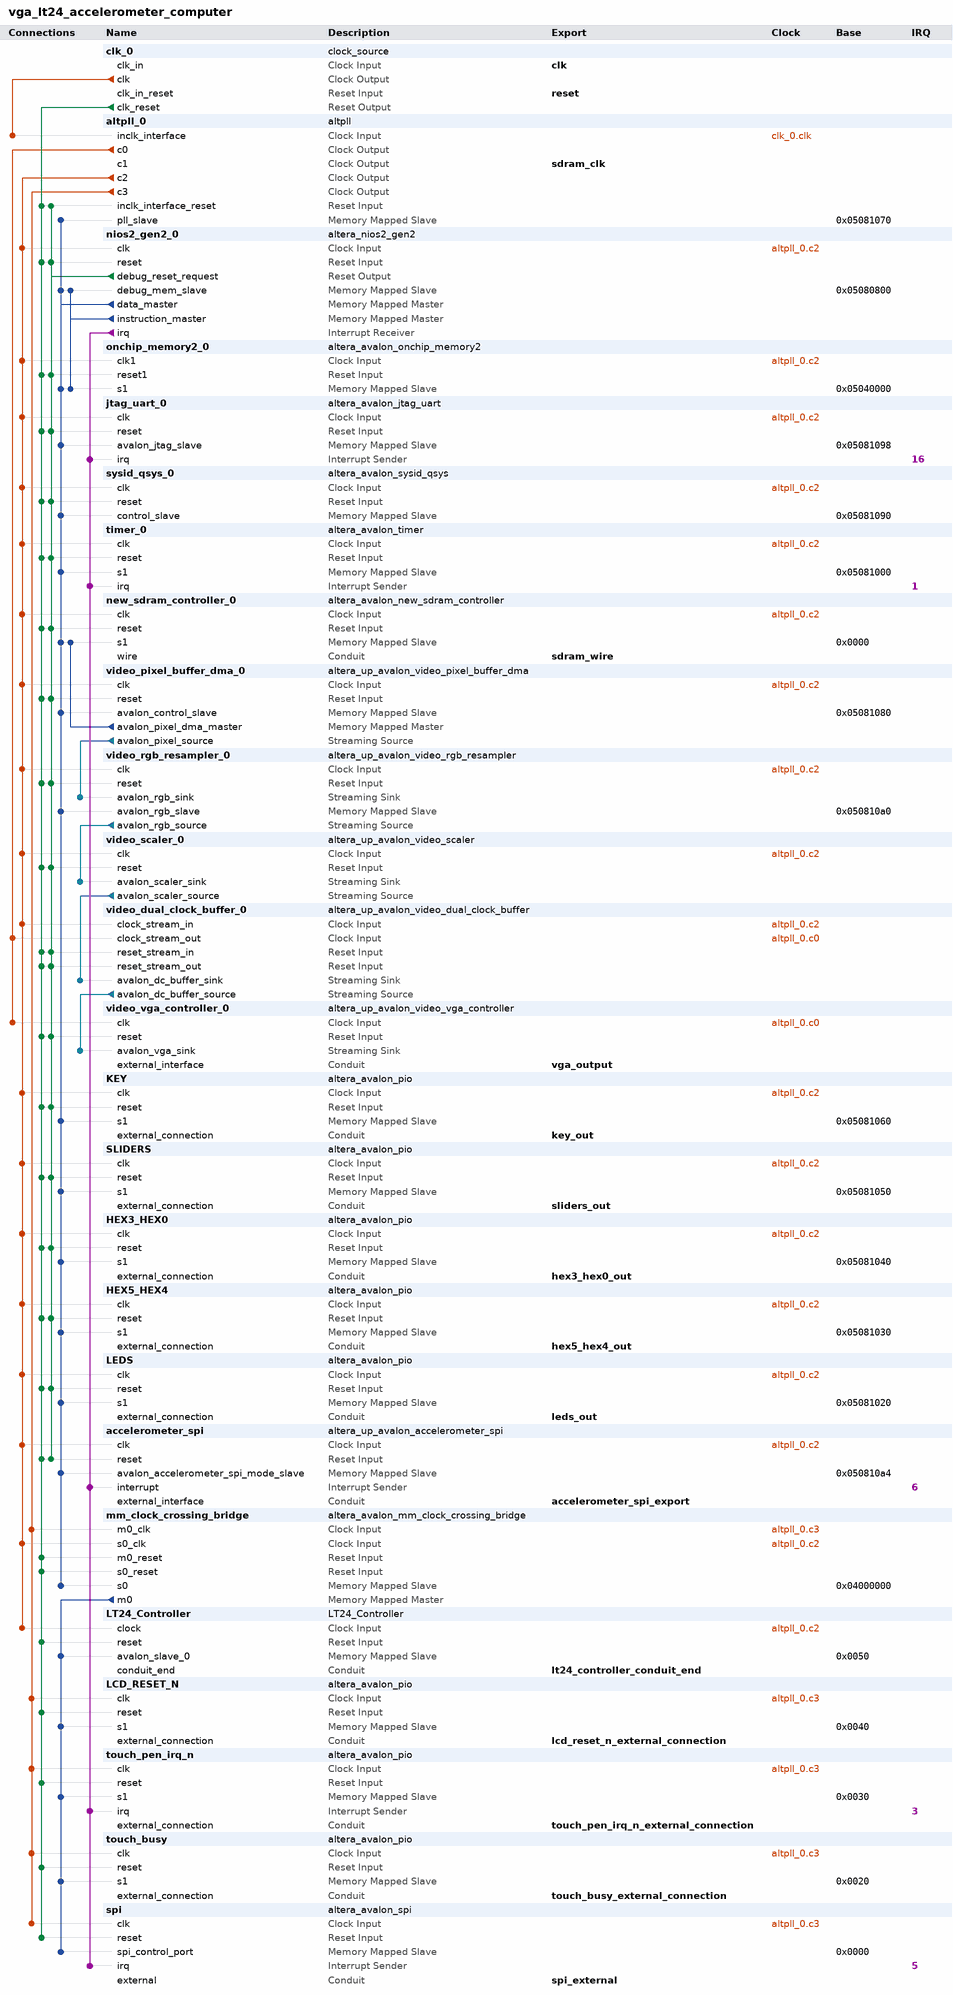
[diagram p0: system contents]
# Platform Designer (Qsys) system vga_lt24_accelerometer_computer, MAX 10 10M50DAF484C6GES
# Parameters at their usual value, and those the tool derives, are not listed.
package require -exact qsys 18.1
create_system vga_lt24_accelerometer_computer
set_project_property DEVICE_FAMILY {MAX 10}
set_project_property DEVICE 10M50DAF484C6GES

add_instance clk_0 clock_source 18.1
set_instance_parameter_value clk_0 clockFrequency 50000000
set_instance_parameter_value clk_0 resetSynchronousEdges DEASSERT

add_instance altpll_0 altpll 18.1
set_instance_parameter_value altpll_0 CLK0_DIVIDE_BY 2
set_instance_parameter_value altpll_0 CLK0_MULTIPLY_BY 1
set_instance_parameter_value altpll_0 CLK1_DIVIDE_BY 5
set_instance_parameter_value altpll_0 CLK1_DUTY_CYCLE 50
set_instance_parameter_value altpll_0 CLK1_MULTIPLY_BY 8
set_instance_parameter_value altpll_0 CLK1_PHASE_SHIFT -3000
set_instance_parameter_value altpll_0 CLK2_DIVIDE_BY 5
set_instance_parameter_value altpll_0 CLK2_DUTY_CYCLE 50
set_instance_parameter_value altpll_0 CLK2_MULTIPLY_BY 8
set_instance_parameter_value altpll_0 CLK2_PHASE_SHIFT 0
set_instance_parameter_value altpll_0 CLK3_DIVIDE_BY 5
set_instance_parameter_value altpll_0 CLK3_DUTY_CYCLE 50
set_instance_parameter_value altpll_0 CLK3_MULTIPLY_BY 1
set_instance_parameter_value altpll_0 CLK3_PHASE_SHIFT 0
set_instance_parameter_value altpll_0 INCLK0_INPUT_FREQUENCY 20000
set_instance_parameter_value altpll_0 PORT_ARESET PORT_UNUSED
set_instance_parameter_value altpll_0 PORT_LOCKED PORT_UNUSED
set_instance_parameter_value altpll_0 PORT_clk1 PORT_USED
set_instance_parameter_value altpll_0 PORT_clk2 PORT_USED
set_instance_parameter_value altpll_0 PORT_clk3 PORT_USED

add_instance nios2_gen2_0 altera_nios2_gen2 18.1
set_instance_parameter_value nios2_gen2_0 dcache_size 2048
set_instance_parameter_value nios2_gen2_0 exceptionSlave onchip_memory2_0.s1
set_instance_parameter_value nios2_gen2_0 icache_size 4096
set_instance_parameter_value nios2_gen2_0 impl Fast
set_instance_parameter_value nios2_gen2_0 resetSlave onchip_memory2_0.s1

add_instance onchip_memory2_0 altera_avalon_onchip_memory2 18.1
set_instance_parameter_value onchip_memory2_0 dataWidth 32
set_instance_parameter_value onchip_memory2_0 dualPort false
set_instance_parameter_value onchip_memory2_0 initMemContent false
set_instance_parameter_value onchip_memory2_0 initializationFileName onchip_mem.hex
set_instance_parameter_value onchip_memory2_0 memorySize 160000

add_instance jtag_uart_0 altera_avalon_jtag_uart 18.1
set_instance_parameter_value jtag_uart_0 simInteractiveOptions NO_INTERACTIVE_WINDOWS

add_instance sysid_qsys_0 altera_avalon_sysid_qsys 18.1
set_instance_parameter_value sysid_qsys_0 id 19

add_instance timer_0 altera_avalon_timer 18.1
set_instance_parameter_value timer_0 period 1
set_instance_parameter_value timer_0 periodUnits MSEC

add_instance new_sdram_controller_0 altera_avalon_new_sdram_controller 18.1
set_instance_parameter_value new_sdram_controller_0 TAC 5.5
set_instance_parameter_value new_sdram_controller_0 TRCD 20.0
set_instance_parameter_value new_sdram_controller_0 TRP 20.0
set_instance_parameter_value new_sdram_controller_0 casLatency 3
set_instance_parameter_value new_sdram_controller_0 columnWidth 10
set_instance_parameter_value new_sdram_controller_0 dataWidth 16
set_instance_parameter_value new_sdram_controller_0 generateSimulationModel false
set_instance_parameter_value new_sdram_controller_0 model single_Micron_MT48LC4M32B2_7_chip
set_instance_parameter_value new_sdram_controller_0 numberOfBanks 4
set_instance_parameter_value new_sdram_controller_0 numberOfChipSelects 1
set_instance_parameter_value new_sdram_controller_0 powerUpDelay 100.0
set_instance_parameter_value new_sdram_controller_0 refreshPeriod 7.8125
set_instance_parameter_value new_sdram_controller_0 rowWidth 13

add_instance video_pixel_buffer_dma_0 altera_up_avalon_video_pixel_buffer_dma 18.0
set_instance_parameter_value video_pixel_buffer_dma_0 addr_mode X-Y
set_instance_parameter_value video_pixel_buffer_dma_0 back_start_address 66060288
set_instance_parameter_value video_pixel_buffer_dma_0 color_space {16-bit RGB}
set_instance_parameter_value video_pixel_buffer_dma_0 image_height 240
set_instance_parameter_value video_pixel_buffer_dma_0 image_width 320
set_instance_parameter_value video_pixel_buffer_dma_0 start_address 65011712

add_instance video_rgb_resampler_0 altera_up_avalon_video_rgb_resampler 18.0
set_instance_parameter_value video_rgb_resampler_0 alpha 1023
set_instance_parameter_value video_rgb_resampler_0 input_type {16-bit RGB}
set_instance_parameter_value video_rgb_resampler_0 output_type {30-bit RGB}

add_instance video_scaler_0 altera_up_avalon_video_scaler 18.0
set_instance_parameter_value video_scaler_0 color_bits 10
set_instance_parameter_value video_scaler_0 color_planes 3
set_instance_parameter_value video_scaler_0 height_scaling 2
set_instance_parameter_value video_scaler_0 width_in 320
set_instance_parameter_value video_scaler_0 width_scaling 2

add_instance video_dual_clock_buffer_0 altera_up_avalon_video_dual_clock_buffer 18.0
set_instance_parameter_value video_dual_clock_buffer_0 color_bits 10

add_instance video_vga_controller_0 altera_up_avalon_video_vga_controller 18.0
set_instance_parameter_value video_vga_controller_0 board DE10-Lite
set_instance_parameter_value video_vga_controller_0 resolution {VGA 640x480}

add_instance KEY altera_avalon_pio 18.1
set_instance_parameter_value KEY captureEdge true
set_instance_parameter_value KEY direction Input
set_instance_parameter_value KEY width 2

add_instance SLIDERS altera_avalon_pio 18.1
set_instance_parameter_value SLIDERS direction Input
set_instance_parameter_value SLIDERS width 10

add_instance HEX3_HEX0 altera_avalon_pio 18.1
set_instance_parameter_value HEX3_HEX0 direction Output
set_instance_parameter_value HEX3_HEX0 width 32

add_instance HEX5_HEX4 altera_avalon_pio 18.1
set_instance_parameter_value HEX5_HEX4 direction Output
set_instance_parameter_value HEX5_HEX4 width 16

add_instance LEDS altera_avalon_pio 18.1
set_instance_parameter_value LEDS direction Output
set_instance_parameter_value LEDS width 10

add_instance accelerometer_spi altera_up_avalon_accelerometer_spi 18.0

add_instance mm_clock_crossing_bridge altera_avalon_mm_clock_crossing_bridge 18.1
set_instance_parameter_value mm_clock_crossing_bridge ADDRESS_WIDTH 10
set_instance_parameter_value mm_clock_crossing_bridge COMMAND_FIFO_DEPTH 8
set_instance_parameter_value mm_clock_crossing_bridge DATA_WIDTH 32
set_instance_parameter_value mm_clock_crossing_bridge MASTER_SYNC_DEPTH 2
set_instance_parameter_value mm_clock_crossing_bridge MAX_BURST_SIZE 1
set_instance_parameter_value mm_clock_crossing_bridge RESPONSE_FIFO_DEPTH 8
set_instance_parameter_value mm_clock_crossing_bridge SLAVE_SYNC_DEPTH 2
set_instance_parameter_value mm_clock_crossing_bridge USE_AUTO_ADDRESS_WIDTH 0

add_instance LT24_Controller LT24_Controller 1.0

add_instance LCD_RESET_N altera_avalon_pio 18.1
set_instance_parameter_value LCD_RESET_N direction Output
set_instance_parameter_value LCD_RESET_N width 1

add_instance touch_pen_irq_n altera_avalon_pio 18.1
set_instance_parameter_value touch_pen_irq_n captureEdge true
set_instance_parameter_value touch_pen_irq_n direction Input
set_instance_parameter_value touch_pen_irq_n edgeType FALLING
set_instance_parameter_value touch_pen_irq_n generateIRQ true
set_instance_parameter_value touch_pen_irq_n irqType EDGE
set_instance_parameter_value touch_pen_irq_n width 1

add_instance touch_busy altera_avalon_pio 18.1
set_instance_parameter_value touch_busy direction Input
set_instance_parameter_value touch_busy width 1

add_instance spi altera_avalon_spi 18.1
set_instance_parameter_value spi clockPolarity 0
set_instance_parameter_value spi dataWidth 8
set_instance_parameter_value spi masterSPI true
set_instance_parameter_value spi numberOfSlaves 1
set_instance_parameter_value spi targetClockRate 32000

# connections
add_connection altpll_0.c0 video_dual_clock_buffer_0.clock_stream_out clock
add_connection altpll_0.c0 video_vga_controller_0.clk clock
add_connection altpll_0.c2 accelerometer_spi.clk clock
add_connection altpll_0.c2 HEX3_HEX0.clk clock
add_connection altpll_0.c2 HEX5_HEX4.clk clock
add_connection altpll_0.c2 jtag_uart_0.clk clock
add_connection altpll_0.c2 KEY.clk clock
add_connection altpll_0.c2 LEDS.clk clock
add_connection altpll_0.c2 LT24_Controller.clock clock
add_connection altpll_0.c2 mm_clock_crossing_bridge.s0_clk clock
add_connection altpll_0.c2 new_sdram_controller_0.clk clock
add_connection altpll_0.c2 nios2_gen2_0.clk clock
add_connection altpll_0.c2 onchip_memory2_0.clk1 clock
add_connection altpll_0.c2 SLIDERS.clk clock
add_connection altpll_0.c2 sysid_qsys_0.clk clock
add_connection altpll_0.c2 timer_0.clk clock
add_connection altpll_0.c2 video_dual_clock_buffer_0.clock_stream_in clock
add_connection altpll_0.c2 video_pixel_buffer_dma_0.clk clock
add_connection altpll_0.c2 video_rgb_resampler_0.clk clock
add_connection altpll_0.c2 video_scaler_0.clk clock
add_connection altpll_0.c3 LCD_RESET_N.clk clock
add_connection altpll_0.c3 mm_clock_crossing_bridge.m0_clk clock
add_connection altpll_0.c3 spi.clk clock
add_connection altpll_0.c3 touch_busy.clk clock
add_connection altpll_0.c3 touch_pen_irq_n.clk clock
add_connection clk_0.clk altpll_0.inclk_interface clock
add_connection clk_0.clk_reset accelerometer_spi.reset reset
add_connection clk_0.clk_reset altpll_0.inclk_interface_reset reset
add_connection clk_0.clk_reset HEX3_HEX0.reset reset
add_connection clk_0.clk_reset HEX5_HEX4.reset reset
add_connection clk_0.clk_reset jtag_uart_0.reset reset
add_connection clk_0.clk_reset KEY.reset reset
add_connection clk_0.clk_reset LCD_RESET_N.reset reset
add_connection clk_0.clk_reset LEDS.reset reset
add_connection clk_0.clk_reset LT24_Controller.reset reset
add_connection clk_0.clk_reset mm_clock_crossing_bridge.m0_reset reset
add_connection clk_0.clk_reset mm_clock_crossing_bridge.s0_reset reset
add_connection clk_0.clk_reset new_sdram_controller_0.reset reset
add_connection clk_0.clk_reset nios2_gen2_0.reset reset
add_connection clk_0.clk_reset onchip_memory2_0.reset1 reset
add_connection clk_0.clk_reset SLIDERS.reset reset
add_connection clk_0.clk_reset spi.reset reset
add_connection clk_0.clk_reset sysid_qsys_0.reset reset
add_connection clk_0.clk_reset timer_0.reset reset
add_connection clk_0.clk_reset touch_busy.reset reset
add_connection clk_0.clk_reset touch_pen_irq_n.reset reset
add_connection clk_0.clk_reset video_dual_clock_buffer_0.reset_stream_in reset
add_connection clk_0.clk_reset video_dual_clock_buffer_0.reset_stream_out reset
add_connection clk_0.clk_reset video_pixel_buffer_dma_0.reset reset
add_connection clk_0.clk_reset video_rgb_resampler_0.reset reset
add_connection clk_0.clk_reset video_scaler_0.reset reset
add_connection clk_0.clk_reset video_vga_controller_0.reset reset
add_connection nios2_gen2_0.debug_reset_request accelerometer_spi.reset reset
add_connection nios2_gen2_0.debug_reset_request altpll_0.inclk_interface_reset reset
add_connection nios2_gen2_0.debug_reset_request HEX3_HEX0.reset reset
add_connection nios2_gen2_0.debug_reset_request HEX5_HEX4.reset reset
add_connection nios2_gen2_0.debug_reset_request jtag_uart_0.reset reset
add_connection nios2_gen2_0.debug_reset_request KEY.reset reset
add_connection nios2_gen2_0.debug_reset_request LEDS.reset reset
add_connection nios2_gen2_0.debug_reset_request new_sdram_controller_0.reset reset
add_connection nios2_gen2_0.debug_reset_request nios2_gen2_0.reset reset
add_connection nios2_gen2_0.debug_reset_request onchip_memory2_0.reset1 reset
add_connection nios2_gen2_0.debug_reset_request SLIDERS.reset reset
add_connection nios2_gen2_0.debug_reset_request sysid_qsys_0.reset reset
add_connection nios2_gen2_0.debug_reset_request timer_0.reset reset
add_connection nios2_gen2_0.debug_reset_request video_dual_clock_buffer_0.reset_stream_in reset
add_connection nios2_gen2_0.debug_reset_request video_dual_clock_buffer_0.reset_stream_out reset
add_connection nios2_gen2_0.debug_reset_request video_pixel_buffer_dma_0.reset reset
add_connection nios2_gen2_0.debug_reset_request video_rgb_resampler_0.reset reset
add_connection nios2_gen2_0.debug_reset_request video_scaler_0.reset reset
add_connection nios2_gen2_0.debug_reset_request video_vga_controller_0.reset reset
add_connection mm_clock_crossing_bridge.m0 LCD_RESET_N.s1 avalon
set_connection_parameter_value mm_clock_crossing_bridge.m0/LCD_RESET_N.s1 baseAddress 0x0040
add_connection mm_clock_crossing_bridge.m0 LT24_Controller.avalon_slave_0 avalon
set_connection_parameter_value mm_clock_crossing_bridge.m0/LT24_Controller.avalon_slave_0 baseAddress 0x0050
add_connection mm_clock_crossing_bridge.m0 spi.spi_control_port avalon
set_connection_parameter_value mm_clock_crossing_bridge.m0/spi.spi_control_port baseAddress 0x0000
add_connection mm_clock_crossing_bridge.m0 touch_busy.s1 avalon
set_connection_parameter_value mm_clock_crossing_bridge.m0/touch_busy.s1 baseAddress 0x0020
add_connection mm_clock_crossing_bridge.m0 touch_pen_irq_n.s1 avalon
set_connection_parameter_value mm_clock_crossing_bridge.m0/touch_pen_irq_n.s1 baseAddress 0x0030
add_connection nios2_gen2_0.data_master accelerometer_spi.avalon_accelerometer_spi_mode_slave avalon
set_connection_parameter_value nios2_gen2_0.data_master/accelerometer_spi.avalon_accelerometer_spi_mode_slave baseAddress 0x050810a4
add_connection nios2_gen2_0.data_master altpll_0.pll_slave avalon
set_connection_parameter_value nios2_gen2_0.data_master/altpll_0.pll_slave baseAddress 0x05081070
add_connection nios2_gen2_0.data_master HEX3_HEX0.s1 avalon
set_connection_parameter_value nios2_gen2_0.data_master/HEX3_HEX0.s1 baseAddress 0x05081040
add_connection nios2_gen2_0.data_master HEX5_HEX4.s1 avalon
set_connection_parameter_value nios2_gen2_0.data_master/HEX5_HEX4.s1 baseAddress 0x05081030
add_connection nios2_gen2_0.data_master jtag_uart_0.avalon_jtag_slave avalon
set_connection_parameter_value nios2_gen2_0.data_master/jtag_uart_0.avalon_jtag_slave baseAddress 0x05081098
add_connection nios2_gen2_0.data_master KEY.s1 avalon
set_connection_parameter_value nios2_gen2_0.data_master/KEY.s1 baseAddress 0x05081060
add_connection nios2_gen2_0.data_master LEDS.s1 avalon
set_connection_parameter_value nios2_gen2_0.data_master/LEDS.s1 baseAddress 0x05081020
add_connection nios2_gen2_0.data_master mm_clock_crossing_bridge.s0 avalon
set_connection_parameter_value nios2_gen2_0.data_master/mm_clock_crossing_bridge.s0 baseAddress 0x04000000
add_connection nios2_gen2_0.data_master new_sdram_controller_0.s1 avalon
set_connection_parameter_value nios2_gen2_0.data_master/new_sdram_controller_0.s1 baseAddress 0x0000
add_connection nios2_gen2_0.data_master nios2_gen2_0.debug_mem_slave avalon
set_connection_parameter_value nios2_gen2_0.data_master/nios2_gen2_0.debug_mem_slave baseAddress 0x05080800
add_connection nios2_gen2_0.data_master onchip_memory2_0.s1 avalon
set_connection_parameter_value nios2_gen2_0.data_master/onchip_memory2_0.s1 baseAddress 0x05040000
add_connection nios2_gen2_0.data_master SLIDERS.s1 avalon
set_connection_parameter_value nios2_gen2_0.data_master/SLIDERS.s1 baseAddress 0x05081050
add_connection nios2_gen2_0.data_master sysid_qsys_0.control_slave avalon
set_connection_parameter_value nios2_gen2_0.data_master/sysid_qsys_0.control_slave baseAddress 0x05081090
add_connection nios2_gen2_0.data_master timer_0.s1 avalon
set_connection_parameter_value nios2_gen2_0.data_master/timer_0.s1 baseAddress 0x05081000
add_connection nios2_gen2_0.data_master video_pixel_buffer_dma_0.avalon_control_slave avalon
set_connection_parameter_value nios2_gen2_0.data_master/video_pixel_buffer_dma_0.avalon_control_slave baseAddress 0x05081080
add_connection nios2_gen2_0.data_master video_rgb_resampler_0.avalon_rgb_slave avalon
set_connection_parameter_value nios2_gen2_0.data_master/video_rgb_resampler_0.avalon_rgb_slave baseAddress 0x050810a0
add_connection nios2_gen2_0.instruction_master nios2_gen2_0.debug_mem_slave avalon
set_connection_parameter_value nios2_gen2_0.instruction_master/nios2_gen2_0.debug_mem_slave baseAddress 0x05080800
add_connection nios2_gen2_0.instruction_master onchip_memory2_0.s1 avalon
set_connection_parameter_value nios2_gen2_0.instruction_master/onchip_memory2_0.s1 baseAddress 0x05040000
add_connection video_pixel_buffer_dma_0.avalon_pixel_dma_master new_sdram_controller_0.s1 avalon
set_connection_parameter_value video_pixel_buffer_dma_0.avalon_pixel_dma_master/new_sdram_controller_0.s1 baseAddress 0x0000
add_connection video_dual_clock_buffer_0.avalon_dc_buffer_source video_vga_controller_0.avalon_vga_sink avalon_streaming
add_connection video_pixel_buffer_dma_0.avalon_pixel_source video_rgb_resampler_0.avalon_rgb_sink avalon_streaming
add_connection video_rgb_resampler_0.avalon_rgb_source video_scaler_0.avalon_scaler_sink avalon_streaming
add_connection video_scaler_0.avalon_scaler_source video_dual_clock_buffer_0.avalon_dc_buffer_sink avalon_streaming
add_connection nios2_gen2_0.irq accelerometer_spi.interrupt interrupt
set_connection_parameter_value nios2_gen2_0.irq/accelerometer_spi.interrupt irqNumber 6
add_connection nios2_gen2_0.irq jtag_uart_0.irq interrupt
set_connection_parameter_value nios2_gen2_0.irq/jtag_uart_0.irq irqNumber 16
add_connection nios2_gen2_0.irq spi.irq interrupt
set_connection_parameter_value nios2_gen2_0.irq/spi.irq irqNumber 5
add_connection nios2_gen2_0.irq timer_0.irq interrupt
set_connection_parameter_value nios2_gen2_0.irq/timer_0.irq irqNumber 1
add_connection nios2_gen2_0.irq touch_pen_irq_n.irq interrupt
set_connection_parameter_value nios2_gen2_0.irq/touch_pen_irq_n.irq irqNumber 3

# exported interfaces
add_interface accelerometer_spi_export conduit end
set_interface_property accelerometer_spi_export EXPORT_OF accelerometer_spi.external_interface
add_interface clk clock sink
set_interface_property clk EXPORT_OF clk_0.clk_in
add_interface hex3_hex0_out conduit end
set_interface_property hex3_hex0_out EXPORT_OF HEX3_HEX0.external_connection
add_interface hex5_hex4_out conduit end
set_interface_property hex5_hex4_out EXPORT_OF HEX5_HEX4.external_connection
add_interface key_out conduit end
set_interface_property key_out EXPORT_OF KEY.external_connection
add_interface lcd_reset_n_external_connection conduit end
set_interface_property lcd_reset_n_external_connection EXPORT_OF LCD_RESET_N.external_connection
add_interface leds_out conduit end
set_interface_property leds_out EXPORT_OF LEDS.external_connection
add_interface lt24_controller_conduit_end conduit end
set_interface_property lt24_controller_conduit_end EXPORT_OF LT24_Controller.conduit_end
add_interface reset reset sink
set_interface_property reset EXPORT_OF clk_0.clk_in_reset
add_interface sdram_clk clock source
set_interface_property sdram_clk EXPORT_OF altpll_0.c1
add_interface sdram_wire conduit end
set_interface_property sdram_wire EXPORT_OF new_sdram_controller_0.wire
add_interface sliders_out conduit end
set_interface_property sliders_out EXPORT_OF SLIDERS.external_connection
add_interface spi_external conduit end
set_interface_property spi_external EXPORT_OF spi.external
add_interface touch_busy_external_connection conduit end
set_interface_property touch_busy_external_connection EXPORT_OF touch_busy.external_connection
add_interface touch_pen_irq_n_external_connection conduit end
set_interface_property touch_pen_irq_n_external_connection EXPORT_OF touch_pen_irq_n.external_connection
add_interface vga_output conduit end
set_interface_property vga_output EXPORT_OF video_vga_controller_0.external_interface

set_interconnect_requirement {$system} qsys_mm.clockCrossingAdapter HANDSHAKE
set_interconnect_requirement {$system} qsys_mm.enableEccProtection FALSE
set_interconnect_requirement {$system} qsys_mm.insertDefaultSlave FALSE
set_interconnect_requirement {$system} qsys_mm.maxAdditionalLatency 1

save_system vga_lt24_accelerometer_computer.qsys
